# Altium schematic sheet DO.SchDoc
size A4 portrait; SheetNumber: 10; SheetTotal: 15
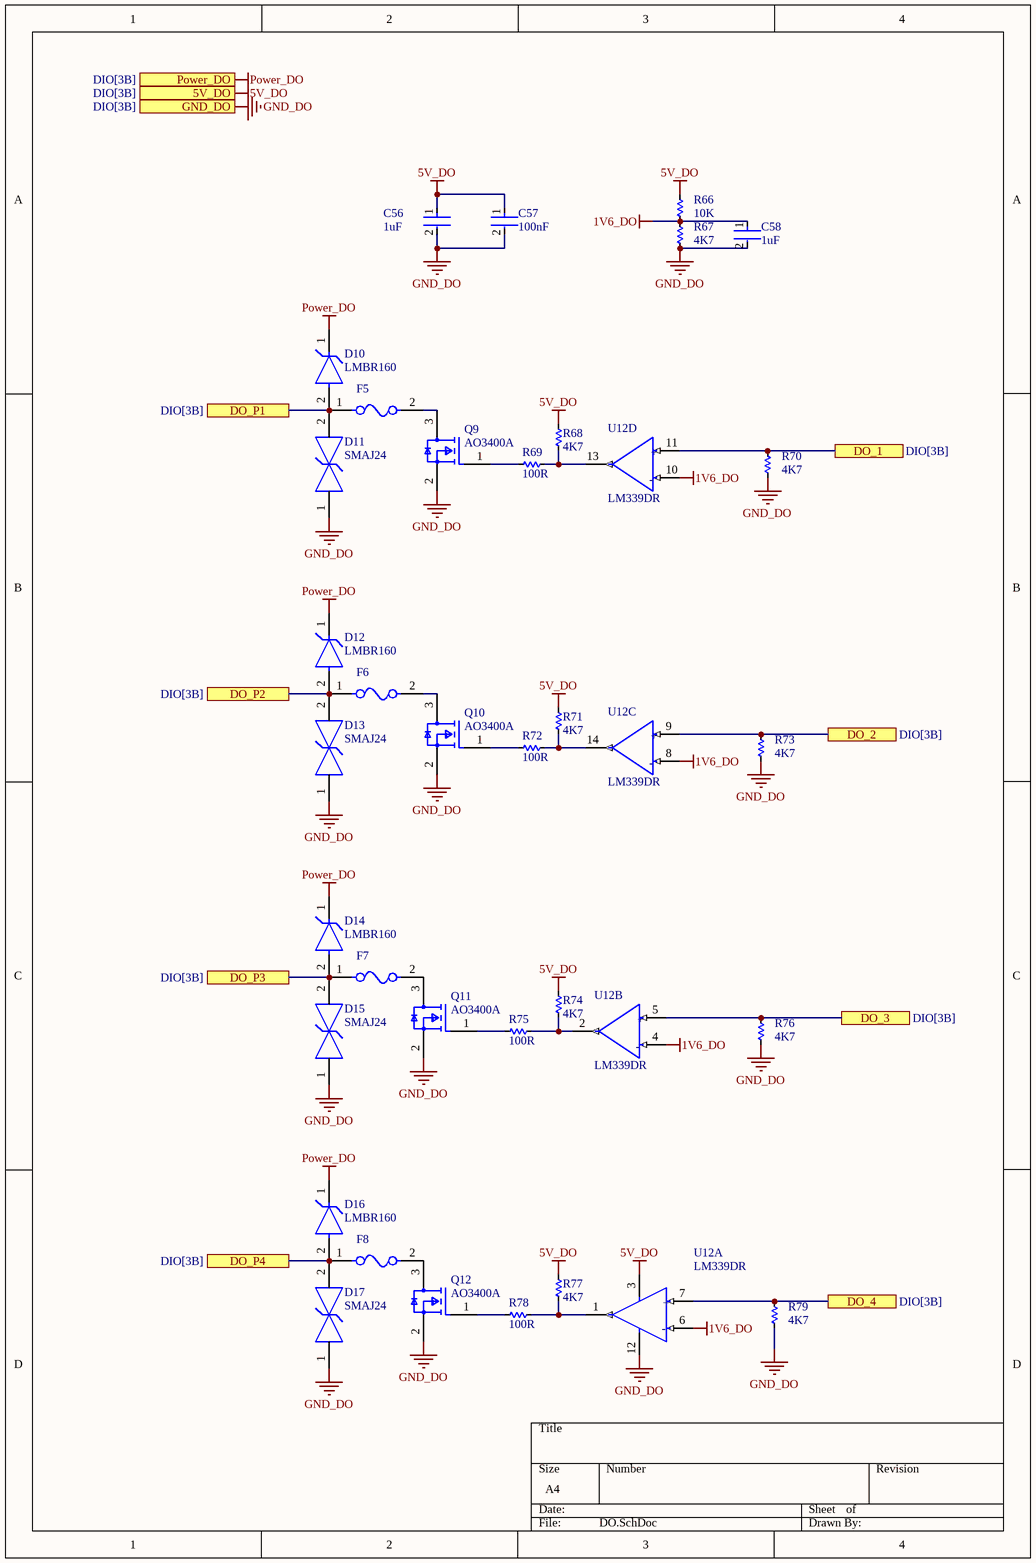
[diagram p0: DO.SchDoc]

## Parts
C56  1uF  [FP-GRM18-0_15-MFG]
C57  100nF  [FP-GRM18-0_15-MFG]
C58  1uF  [FP-GRM18-0_15-MFG]
D10  LMBR160  [FP-SOD123-MFG]
D11  SMAJ24  [FP-SMAJ-MFG]
D12  LMBR160  [FP-SOD123-MFG]
D13  SMAJ24  [FP-SMAJ-MFG]
D14  LMBR160  [FP-SOD123-MFG]
D15  SMAJ24  [FP-SMAJ-MFG]
D16  LMBR160  [FP-SOD123-MFG]
D17  SMAJ24  [FP-SMAJ-MFG]
F5  2A 30V  [FP-0468-MFG]  (value not drawn)
F6  2A 30V  [FP-0468-MFG]  (value not drawn)
F7  2A 30V  [FP-0468-MFG]  (value not drawn)
F8  2A 30V  [FP-0468-MFG]  (value not drawn)
Q9  AO3400A  [FP-SOT23-MFG]
Q10  AO3400A  [FP-SOT23-MFG]
Q11  AO3400A  [FP-SOT23-MFG]
Q12  AO3400A  [FP-SOT23-MFG]
R66  10K  [RES-SMD-0603]
R67  4K7  [RES-SMD-0603]
R68  4K7  [RES-SMD-0603]
R69  100R  [RES-SMD-0603]
R70  4K7  [RES-SMD-0603]
R71  4K7  [RES-SMD-0603]
R72  100R  [RES-SMD-0603]
R73  4K7  [RES-SMD-0603]
R74  4K7  [RES-SMD-0603]
R75  100R  [RES-SMD-0603]
R76  4K7  [RES-SMD-0603]
R77  4K7  [RES-SMD-0603]
R78  100R  [RES-SMD-0603]
R79  4K7  [RES-SMD-0603]
U12  LM339DR  [FP-D0014A-IPC_A]  (parts A,B,C,D of 4)

## Ports
5V_DO (see DIO[3B]), DO_1 (see DIO[3B]), DO_2 (see DIO[3B]), DO_3 (see DIO[3B]), DO_4 (see DIO[3B]), DO_P1 (see DIO[3B]), DO_P2 (see DIO[3B]), DO_P3 (see DIO[3B]), DO_P4 (see DIO[3B]), GND_DO (see DIO[3B]), Power_DO (see DIO[3B])

## Nets
1V6_DO: C58.1 R66.2 R67.1 U12.4(2IN-) U12.6(1IN-) U12.8(3IN-) U12.10(4IN-)
5V_DO: C56.1 C57.1 R66.1 R68.2 R71.2 R74.2 R77.2 U12.3(VCC) ; port 5V_DO
GND_DO: C56.2 C57.2 C58.2 D11.1 D13.1 D15.1 D17.1 Q9.2(S) Q10.2(S) Q11.2(S) Q12.2(S) R67.2 R70.2 R73.2 R76.2 R79.2 U12.12(GND) ; port GND_DO
Power_DO: D10.1(C) D12.1(C) D14.1(C) D16.1(C) ; port Power_DO
DO_1: R70.1 U12.11(4IN+) ; port DO_1
DO_2: R73.1 U12.9(3IN+) ; port DO_2
DO_3: R76.1 U12.5(2IN+) ; port DO_3
DO_4: R79.1 U12.7(1IN+) ; port DO_4
DO_P1: D10.2(A) D11.2 F5.1 ; port DO_P1
DO_P2: D12.2(A) D13.2 F6.1 ; port DO_P2
DO_P3: D14.2(A) D15.2 F7.1 ; port DO_P3
DO_P4: D16.2(A) D17.2 F8.1 ; port DO_P4
NetF5_2: F5.2 Q9.3(D)
NetF6_2: F6.2 Q10.3(D)
NetF7_2: F7.2 Q11.3(D)
NetF8_2: F8.2 Q12.3(D)
NetQ9_1: Q9.1(G) R69.1
NetQ10_1: Q10.1(G) R72.1
NetQ11_1: Q11.1(G) R75.1
NetQ12_1: Q12.1(G) R78.1
NetR68_1: R68.1 R69.2 U12.13(OUT4)
NetR71_1: R71.1 R72.2 U12.14(OUT3)
NetR74_1: R74.1 R75.2 U12.2(2OUT)
NetR77_1: R77.1 R78.2 U12.1(1OUT)

## Notes on the sheet
- (in symbol CMP-04896-000028-1, part A) +; -
- (in symbol CMP-04896-000028-1, part B) +; -
- (in symbol CMP-04896-000028-1, part C) +; -
- (in symbol CMP-04896-000028-1, part D) +; -

## Library data of the parts
C56 = CMP-2000-05448-2: CAP CER 1UF 10V X5R 0603; Manufacturer Part Number: GRM188R61A106KE69D; Manufacturer: Murata; Temperature Coefficient: 15%; Value: 10uF; Material: Ceramic; Tolerance: 10%; Device Class L1: Passive Components; ComponentLink2Description: Datasheet; Height: 0.95mm; Package: GRM18-0.15; Octopart: https://octopart.com/grm188r61a106ke69d-murata-22851381; Digikey Description: CAP CER 10UF 10V X5R 0603; Temperature Range High: +85°C; Temperature Range Low: -55°C; Temperature Characteristic: X5R; Capacitance: 10uF; RoHS: TRUE; Device Class L2: Capacitors; ComponentLink2URL: https://search.murata.co.jp/Ceramy/image/img/A01X/G101/ENG/GRM188R61A106KE69-01A.pdf; Device Class L3: Ceramic Capacitors; Lead Free: Yes; Mouser Description: Multilayer Ceramic Capacitors MLCC - SMD/SMT 0603 10uF 10volts X5R + - 10%; Category: Cap; Voltage Rating: 10V; Temperature: -55°C to +85°C; Automotive: No
C57 = CMP-2000-05448-2: CAP CER 100nF 10V X5R 0603; Manufacturer Part Number: GRM188R61A106KE69D; Manufacturer: Murata; Temperature Coefficient: 15%; Value: 10uF; Material: Ceramic; Tolerance: 10%; Device Class L1: Passive Components; ComponentLink2Description: Datasheet; Height: 0.95mm; Package: GRM18-0.15; Octopart: https://octopart.com/grm188r61a106ke69d-murata-22851381; Digikey Description: CAP CER 10UF 10V X5R 0603; Temperature Range High: +85°C; Temperature Range Low: -55°C; Temperature Characteristic: X5R; Capacitance: 10uF; RoHS: TRUE; Device Class L2: Capacitors; ComponentLink2URL: https://search.murata.co.jp/Ceramy/image/img/A01X/G101/ENG/GRM188R61A106KE69-01A.pdf; Device Class L3: Ceramic Capacitors; Lead Free: Yes; Mouser Description: Multilayer Ceramic Capacitors MLCC - SMD/SMT 0603 10uF 10volts X5R + - 10%; Category: Cap; Voltage Rating: 10V; Temperature: -55°C to +85°C; Automotive: No
C58 = CMP-2000-05448-2: CAP CER 1uF 10V X5R 0603; Manufacturer Part Number: GRM188R61A106KE69D; Manufacturer: Murata; Temperature Coefficient: 15%; Value: 10uF; Material: Ceramic; Tolerance: 10%; Device Class L1: Passive Components; ComponentLink2Description: Datasheet; Height: 0.95mm; Package: GRM18-0.15; Octopart: https://octopart.com/grm188r61a106ke69d-murata-22851381; Digikey Description: CAP CER 10UF 10V X5R 0603; Temperature Range High: +85°C; Temperature Range Low: -55°C; Temperature Characteristic: X5R; Capacitance: 10uF; RoHS: TRUE; Device Class L2: Capacitors; ComponentLink2URL: https://search.murata.co.jp/Ceramy/image/img/A01X/G101/ENG/GRM188R61A106KE69-01A.pdf; Device Class L3: Ceramic Capacitors; Lead Free: Yes; Mouser Description: Multilayer Ceramic Capacitors MLCC - SMD/SMT 0603 10uF 10volts X5R + - 10%; Category: Cap; Voltage Rating: 10V; Temperature: -55°C to +85°C; Automotive: No
D10 D12 D14 D16 = CMP-00461-00326579-1: LMBR160 SOD123 Diode Schottky 1A 60V; NexarPartId: 326579; ESD Protection: No; Power Rating: 500mW; Forward Voltage: 900mV; Voltage Rating (DC): 20V; Impedance: 55Ω; Tolerance: 6%; Test Current: 5mA; Element Configuration: Single; Output Current: 50mA; Max Reverse Leakage Current: 100nA; Height: 1.35mm; Mount: Surface Mount; RoHS: Compliant; Contact Plating: Tin; Radiation Hardening: No; REACH SVHC: No SVHC; Max Power Dissipation: 500mW; Lead Free: Lead Free; Min Operating Temperature: -65°C; Max Operating Temperature: 150°C; Packaging: Cut Tape; Length: 2.85mm; Power Dissipation: 500mW; Schedule B: 8541100050, 8541100050; Zener Voltage: 20V; Zener Current: 5mA; Weight: 10.007382mg; Peak Reverse Current: 100nA; Width: 1.7mm; Voltage Tolerance: 6%; Termination: SMD/SMT; Working Voltage: 20V; Number of Pins: 2
D11 D13 D15 D17 = CMP-08607-000067-1: Tvs Diode 24V 38.9V SMA; Manufacturer: Littelfuse Inc; Manufacturer Part Number: SMAJ58CA; Reverse Standoff Voltage: 58V; Breakdown Voltage: 64.4V; Peak Pulse Current: 4.3A; Peak Pulse Power: 400W; Direction: Bidirectional; Clamping Voltage: 93.6V; Number Of Channels: 1; Max Junction Temp: +150°C; Device Class L2: TVS Diodes; ComponentLink2Description: Datasheet; Lead Free: Yes; Height: 2.29mm; Automotive: No; Package: SMAJ; Digikey Description: TVS DIODE 58V 93.6V DO214AC; Temperature Range Low: -65°C; Device Class L1: Circuit Protection; Temperature Range High: +150°C; Mouser Description: In a Pack of 25, Littelfuse SMAJ58CA, Bi-Directional TVS Diode, 400W, 2-Pin DO-214AC; Octopart: https://octopart.com/smaj58ca-littelfuse-350202; ComponentLink2URL: https://www.littelfuse.com/~/media/electronics/datasheets/tvs_diodes/littelfuse_tvs_diode_smaj_datasheet.pdf.pdf; Temperature: -65°C to +150°C; Device Class L3: unset; Category: Diode; RoHS: TRUE
F5-F8 = CMP-08605-000076-1: SMD1206P200TF/30 Cầu chì tự phục hồi PPTC 2A 30V SMD1206; Manufacturer Part Number: 0468.500NR; Manufacturer: Littelfuse; Fuse Voltage Drop: 156.77mV; Fuse I2T: 0.031A2Sec; Fuse Interrupt Dc Current: 50A; Fuse Current: 0.5A; Resistance: 0.27Ω; Max Fuse Dc Voltage: 63V; Fuse Blow Speed: Slow; Value: 0.27Ω; Package: 0468; Digikey Description: FUSE BOARD MOUNT 500MA 63VAC/VDC; Mouser Description: Surface Mount Fuses 63V .5A Slo-Blo; Temperature Range High: +90°C; Lead Free: Yes; Height: 0.762mm; Device Class L1: Circuit Protection; Category: Fuse; Octopart: https://octopart.com/0468.500nr-littelfuse-672821; Fuse Interrupt Ac Current: 50A; Temperature Range Low: -55°C; Automotive: No; ComponentLink2URL: https://www.littelfuse.com/~/media/electronics/datasheets/fuses/littelfuse_fuse_468_datasheet.pdf.pdf; ComponentLink2Description: Datasheet; RoHS: TRUE; Max Fuse Ac Voltage: 63V; Temperature: -55°C to +90°C; Device Class L2: Fuses; Device Class L3: unset; Voltage Rating: 63V
  F6: ComponentLink3Description: New link; ComponentLink3URL: https://linhkien.cxtvn.com/6537-cau-chi-tu-phuc-hoi-pptc-smd1206.html
Q9-Q12 = CMP-83955-000006-1: AO3400 SOT23-3 MOSFET N-1CH 5A 30V (A09T); Input Capacitance: 630pF; Number of Elements: 1; Rds On Max: 26.5mR; Max Power Dissipation: 1.4W; Continuous Drain Current (ID): 5.7A; Gate to Source Voltage (Vgs): 12V; Min Operating Temperature: -55°C; Lead Free: Lead Free; Number of Pins: 3; Drain to Source Voltage (Vdss): 30V; Case/Package: SOT-23; Mount: Surface Mount; Radiation Hardening: No; Packaging: Tape and Reel; Max Operating Temperature: 150°C; Power Dissipation: 1.4W
R66-R79 = Res-SMD: Res 0603 5%; Manufacturer: Generic Components; Class: Passive; Published: 08/06/2000; Publisher: Altium Hobart Technology Centre
U12 = CMP-04896-000028-1: IC QUAD DIFF COMP 14-SOIC; Manufacturer: Texas Instruments; Nominal Supply Current: 0.8mA; Min Dual Supply Voltage: 1V; Number Of Channels: 4; Input Offset Voltage: 2mV; Max Junction Temp: +70°C; Min Supply Voltage: 2V; Response Time: 1.3us; Max Dual Supply Voltage: 18V; Max Supply Voltage: 30V; Standoff Height: 0.1mm; Input Bias Current: -0.025uA; Output Current Per Channel: 6mA; Category: IC; Octopart: https://octopart.com/lm339dr-texas+instruments-45532; Automotive: No; Temperature: 0°C to +70°C; Ipc Land Pattern Name: SOIC127P600X175-14; Temperature Range Low: 0°C; Mouser Description: Analog Comparators Quad Differential; Lead Free: Yes; Digikey Description: IC QUAD DIFF COMP 14-SOIC; ComponentLink2URL: http://www.ti.com/lit/ds/symlink/lm339.pdf; Device Class L3: Comparators; Manufacturer Part Number: LM339DR; Temperature Range High: +70°C; Device Class L2: Linear ICs; Height: 1.75mm; Device Class L1: Integrated Circuits (ICs); Package: D0014A; RoHS: TRUE; ComponentLink2Description: Datasheet